# Altium schematic sheet MCU_board_1.SchDoc
size A4; SheetNumber: 1; SheetTotal: 3
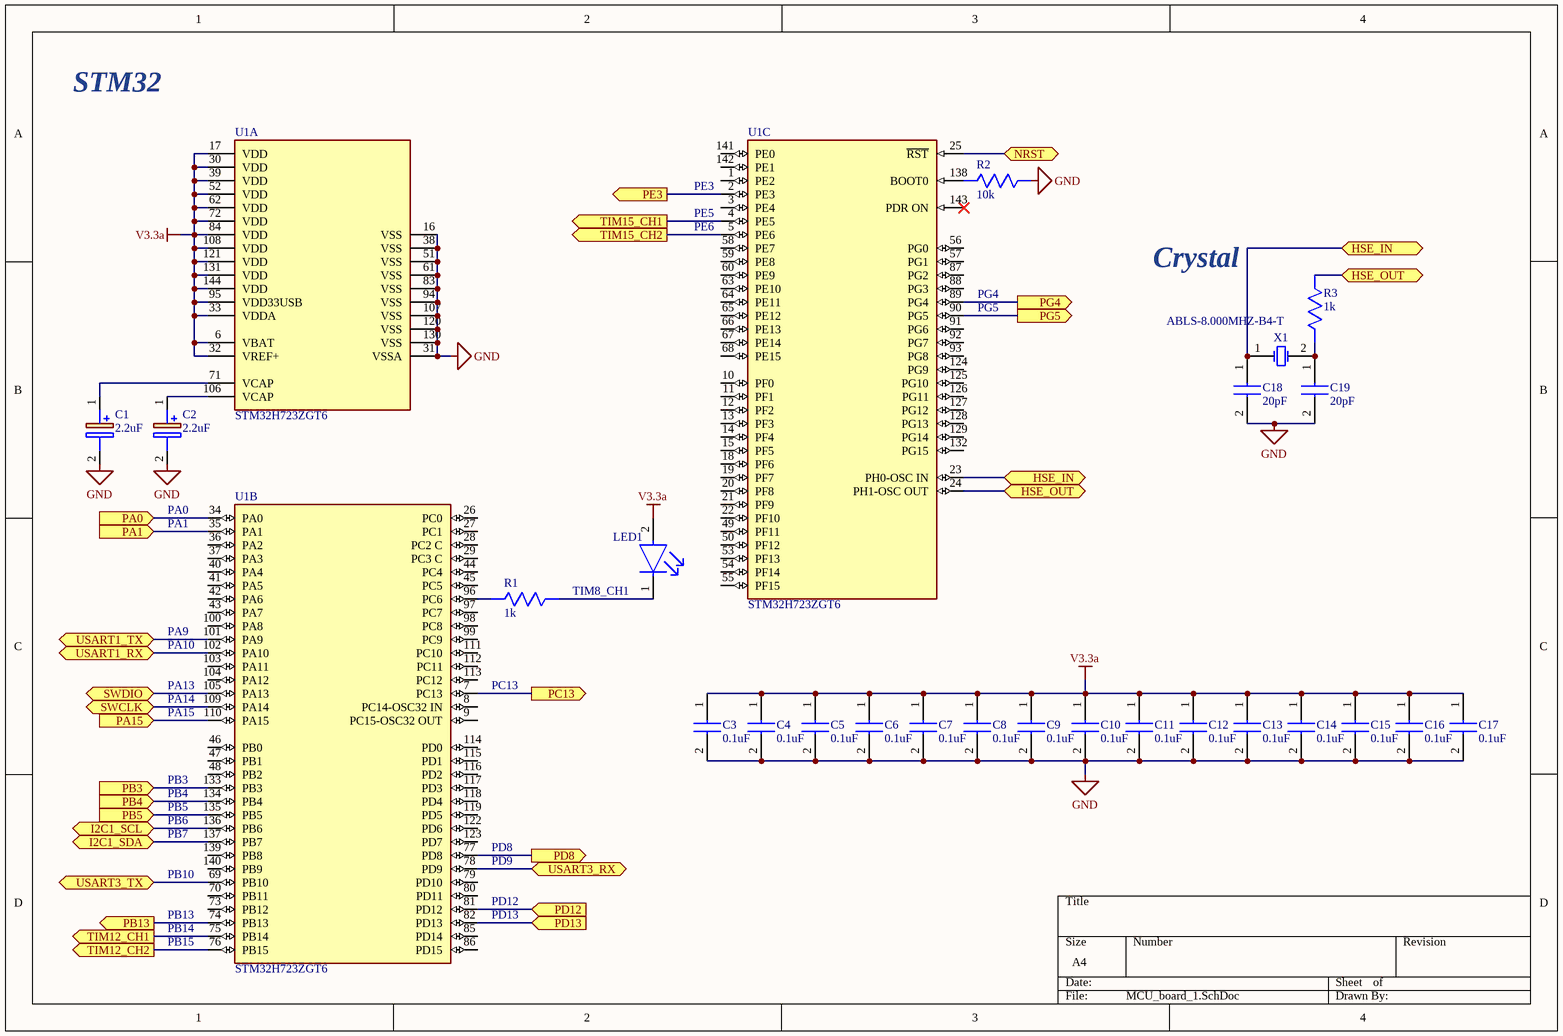
[diagram p0: MCU_board_1.SchDoc]

## Parts
(Parts that share a designator on the sheet are numbered #1, #2 ... from top to bottom, then left to right.)
C1  2.2uF  [T598B]
C2  2.2uF  [T598B]
C3  0.1uF  [CAPC1608X90N]
C4  0.1uF  [CAPC1608X90N]
C5  0.1uF  [CAPC1608X90N]
C6  0.1uF  [CAPC1608X90N]
C7  0.1uF  [CAPC1608X90N]
C8  0.1uF  [CAPC1608X90N]
C9  0.1uF  [CAPC1608X90N]
C10  0.1uF  [CAPC1608X90N]
C11  0.1uF  [CAPC1608X90N]
C12  0.1uF  [CAPC1608X90N]
C13  0.1uF  [CAPC1608X90N]
C14  0.1uF  [CAPC1608X90N]
C15  0.1uF  [CAPC1608X90N]
C16  0.1uF  [CAPC1608X90N]
C17  0.1uF  [CAPC1608X90N]
C18  20pF  [CAPC1608X90N]
C19  20pF  [CAPC1608X90N]
LED1  150060RS75000  [FP-150060RS75000-MFG]  (value not drawn)
R1  1k  [RESC1608X55N]
R2  10k  [RESC1608X55N]
R3  1k  [RESC1608X55N]
U1#1  STM32H723ZGT6  [FP-LQFP144-1A-IPC_A]  (part A of 3)
U1#2  STM32H723ZGT6  [FP-LQFP144-1A-IPC_C]  (parts B,C of 3)
X1  ABLS-8.000MHZ-B4-T  [ABRA-ABLS-14.7456MHZ-B2-T_V]

## Ports
HSE_IN (bidir, see MCU_board_1[3B]), HSE_IN (bidir, see MCU_board_1[4A]), HSE_OUT (bidir, see MCU_board_1[3B]), HSE_OUT (bidir, see MCU_board_1[4B]), I2C1_SCL (bidir, see MCU_board_3[1B]), I2C1_SDA (bidir, see MCU_board_3[1B]), NRST (bidir, see MCU_board_2[1C], MCU_board_2[2C], MCU_board_3[1C]), PA0 (in, see MCU_board_3[3C]), PA1 (in, see MCU_board_3[3C]), PA15 (in, see MCU_board_3[2C]), PB3 (in, see MCU_board_3[1C], MCU_board_3[2C]), PB4 (in, see MCU_board_3[3C]), PB5 (in, see MCU_board_3[3C]), PB13 (out, see MCU_board_3[3D]), PC13 (out, see MCU_board_3[3D]), PD8 (out, see MCU_board_3[3D]), PD12 (in, see MCU_board_3[4C]), PD13 (in, see MCU_board_3[4C]), PE3 (out, see MCU_board_3[3D]), PG4 (out, see MCU_board_2[1D]), PG5 (out, see MCU_board_2[2D]), SWCLK (bidir, see MCU_board_3[2C]), SWDIO (bidir, see MCU_board_3[2C]), TIM12_CH1 (out, see MCU_board_3[3D]), TIM12_CH2 (out, see MCU_board_3[3D]), TIM15_CH1 (out, see MCU_board_3[3D]), TIM15_CH2 (out, see MCU_board_3[3C]), USART1_RX (bidir, see MCU_board_2[4C], MCU_board_3[1A]), USART1_TX (bidir, see MCU_board_2[4C], MCU_board_3[1A]), USART3_RX (bidir, see MCU_board_3[2A]), USART3_TX (bidir, see MCU_board_3[2A])

## Nets
GND: C1.2(-) C2.2(-) C3.2 C4.2 C5.2 C6.2 C7.2 C8.2 C9.2 C10.2 C11.2 C12.2 C13.2 C14.2 C15.2 C16.2 C17.2 C18.2 C19.2 R2.2 U1#1.16(VSS) U1#1.31(VSSA) U1#1.38(VSS) U1#1.51(VSS) U1#1.61(VSS) U1#1.83(VSS) U1#1.94(VSS) U1#1.107(VSS) U1#1.120(VSS) U1#1.130(VSS)
V3.3a: C3.1 C4.1 C5.1 C6.1 C7.1 C8.1 C9.1 C10.1 C11.1 C12.1 C13.1 C14.1 C15.1 C16.1 C17.1 LED1.2(A) U1#1.6(VBAT) U1#1.17(VDD) U1#1.30(VDD) U1#1.32(VREF+) U1#1.33(VDDA) U1#1.39(VDD) U1#1.52(VDD) U1#1.62(VDD) U1#1.72(VDD) U1#1.84(VDD) U1#1.95(VDD33USB) U1#1.108(VDD) U1#1.121(VDD) U1#1.131(VDD) U1#1.144(VDD)
HSE_IN: C18.1 U1#2.23(PH0-OSC_IN) X1.1(X1) ; port HSE_IN
HSE_OUT: R3.2 U1#2.24(PH1-OSC_OUT) ; port HSE_OUT
I2C1_SCL: U1#2.136(PB6) ; port I2C1_SCL
I2C1_SDA: U1#2.137(PB7) ; port I2C1_SDA
NRST: U1#2.25(~{RST}) ; port NRST
PA0: U1#2.34(PA0) ; port PA0
PA1: U1#2.35(PA1) ; port PA1
PA15: U1#2.110(PA15) ; port PA15
PB3: U1#2.133(PB3) ; port PB3
PB4: U1#2.134(PB4) ; port PB4
PB5: U1#2.135(PB5) ; port PB5
PB13: U1#2.74(PB13) ; port PB13
PC13: U1#2.7(PC13) ; port PC13
PD8: U1#2.77(PD8) ; port PD8
PD12: U1#2.81(PD12) ; port PD12
PD13: U1#2.82(PD13) ; port PD13
PE3: U1#2.2(PE3) ; port PE3
PG4: U1#2.89(PG4) ; port PG4
PG5: U1#2.90(PG5) ; port PG5
SWCLK: U1#2.109(PA14) ; port SWCLK
SWDIO: U1#2.105(PA13) ; port SWDIO
TIM12_CH1: U1#2.75(PB14) ; port TIM12_CH1
TIM12_CH2: U1#2.76(PB15) ; port TIM12_CH2
TIM15_CH1: U1#2.4(PE5) ; port TIM15_CH1
TIM15_CH2: U1#2.5(PE6) ; port TIM15_CH2
USART1_RX: U1#2.102(PA10) ; port USART1_RX
USART1_TX: U1#2.101(PA9) ; port USART1_TX
USART3_RX: U1#2.78(PD9) ; port USART3_RX
USART3_TX: U1#2.69(PB10) ; port USART3_TX
NetC1_1: C1.1(+) U1#1.71(VCAP)
NetC2_1: C2.1(+) U1#1.106(VCAP)
NetC19_1: C19.1 R3.1 X1.2(X2)
NetLED1_1: LED1.1(C) R1.2
NetR1_1: R1.1 U1#2.96(PC6)
NetR2_1: R2.1 U1#2.138(BOOT0)

Not connected (* = marked no-connect by the designer): U1#2 1(PE2) 3(PE4) 8(PC14-OSC32_IN) 9(PC15-OSC32_OUT) 10(PF0) 11(PF1) 12(PF2) 13(PF3) 14(PF4) 15(PF5) 18(PF6) 19(PF7) 20(PF8) 21(PF9) 22(PF10) 26(PC0) 27(PC1) 28(PC2_C) 29(PC3_C) 36(PA2) 37(PA3) 40(PA4) 41(PA5) 42(PA6) 43(PA7) 44(PC4) 45(PC5) 46(PB0) 47(PB1) 48(PB2) 49(PF11) 50(PF12) 53(PF13) 54(PF14) 55(PF15) 56(PG0) 57(PG1) 58(PE7) 59(PE8) 60(PE9) 63(PE10) 64(PE11) 65(PE12) 66(PE13) 67(PE14) 68(PE15) 70(PB11) 73(PB12) 79(PD10) 80(PD11) 85(PD14) 86(PD15) 87(PG2) 88(PG3) 91(PG6) 92(PG7) 93(PG8) 97(PC7) 98(PC8) 99(PC9) 100(PA8) 103(PA11) 104(PA12) 111(PC10) 112(PC11) 113(PC12) 114(PD0) 115(PD1) 116(PD2) 117(PD3) 118(PD4) 119(PD5) 122(PD6) 123(PD7) 124(PG9) 125(PG10) 126(PG11) 127(PG12) 128(PG13) 129(PG14) 132(PG15) 139(PB8) 140(PB9) 141(PE0) 142(PE1) 143(PDR_ON)*

## Notes on the sheet
- STM32
- (near U1#2) PE3
- (near U1#2) PE5
- (near U1#2) PE6
- (near U1#2) PG4
- (near U1#2) PG5
- Crystal
- PA0
- PA1
- (near U1#2) PA9
- (near U1#2) PA10
- TIM8_CH1
- (near U1#2) PA13
- (near U1#2) PA14
- (near U1#2) PA15
- (near U1#2) PC13
- (near U1#2) PB3
- (near U1#2) PB4
- (near U1#2) PB5
- (near U1#2) PB6
- (near U1#2) PB7
- (near U1#2) PD8
- (near U1#2) PB10
- (near U1#2) PB13
- (near U1#2) PD9
- (near U1#2) PD12
- (near U1#2) PD13
- (near U1#2) PB14
- (near U1#2) PB15

## Library data of the parts
C1 C2 = T598B225M035ATE150: Capacitor Polarised; Manufacturer_Name: KEMET; Datasheet Link: https://content.kemet.com/datasheets/KEM_T2073_T59X.pdf; Height: 2.1mm; Manufacturer_Part_Number: T598B225M035ATE150; Mouser Part Number: 80-T598B225M35ATE150; Mouser Price/Stock: https://www.mouser.co.uk/ProductDetail/KEMET/T598B225M035ATE150?qs=wnTfsH77Xs5uc%252Bb8LBvYtg%3D%3D
C3-C17 = GRM188R72A104MA35D: Capacitor; Manufacturer_Name: Murata Electronics; Height: 0.9mm; Manufacturer_Part_Number: GRM188R72A104MA35D; Mouser Part Number: 81-GRM188R72A104MA5D; Mouser Price/Stock: https://www.mouser.co.uk/ProductDetail/Murata-Electronics/GRM188R72A104MA35D?qs=QdePRyQsNGaEtttrWFG%2FPQ%3D%3D; Arrow Part Number: GRM188R72A104MA35D; Arrow Price/Stock: https://www.arrow.com/en/products/grm188r72a104ma35d/murata-manufacturing?region=nac
C18 C19 = 06035A200FAT2A: Capacitor; Manufacturer_Name: AVX; Datasheet Link: https://componentsearchengine.com/Datasheets/1/06031A100FAT2A.pdf; Height: 0.9mm; Manufacturer_Part_Number: 06035A200FAT2A; Mouser Part Number: 581-06035A200FAT2A; Mouser Price/Stock: https://www.mouser.co.uk/ProductDetail/AVX/06035A200FAT2A?qs=0yaOSdwiqWsd0YnmvPoF5Q%3D%3D
LED1 = CMP-1426-00001-2: LED RED CLEAR 0603 SMD; Luminous Intensity: 250mcd; Viewing Angle: 140°; Dominant Wavelength: 625nm; Test Current: 20mA; Forward Current: 30mA; Forward Voltage: 2V; Lens Color: Colorless; Lens Size: 0.7mm; Width: 0.8mm; Series: WL-SMCW; Color: Red; Min Operating Temperature: -40°C; RoHS Compliant: Yes; Height: 0.8mm; Package Quantity: 1; Packaging: Cut Tape; Mount: Surface Mount; Case/Package: 0603; Lens Transparency: Clear; Length: 1.6mm; Case Code (Imperial): 0603; Lens Style: Clear; Wavelength: 625nm; Max Operating Temperature: 85°C; Case Code (Metric): 1608
R1-R3 = CMP0603-FX-1003ELF: Resistor; Manufacturer_Name: Bourns; Datasheet Link: https://www.mouser.co.uk/datasheet/2/54/Bourns_CMP_Datasheet_05.28.20-1854233.pdf; Height: 0.55mm; Manufacturer_Part_Number: CMP0603-FX-1003ELF
U1#1 U1#2 = CMP-12105-000148-1: IC MCU 32BIT 1MB FLASH 144LQFP
X1 = CMP-2000-05726-1: Low Profile Crystal, 8.0 MHz, +/- 30 ppm, -20 to 70 degC, 2-Pin SMD, RoHS, Tape and Reel; Brand: ABRACON; Case Length: 11.4mm; Frequency Stability: 50PPM; ESR: 80Ohms; Case Height: 4.2mm; Tolerance: 30PPM; Frequency: 8MHz; Case Width: 4.7mm; Load Capacitance: 18pF; Datasheet Version: 04/2011; Termination Style: SMD/SMT; Dimensions: 4.7mmWx11.4mmLx4.2mmH; Packaging: Reel; Manufacturer: ABRACON; Package URL: http://www.abracon.com/Support/PackageDrawing/Resonators/ABLS-2D.pdf; Mounting Technology: SurfaceMount; Package Reference: ABLS-14.7456MHZ-B2-T; Product Category: Crystals; Package Description: 2-Pin Surface Mount Device, Body 11.4 x 4.7 mm; Package / Case: HC-49/US; Mounting Style: SMD/SMT; Operating Temperature Range: -20Cto+70C; Series: ABLS; Factory Pack Quantity: 1000; Datasheet URL: http://www.abracon.com/Resonators/abls.pdf; Manufacturer URL: http://www.abracon.com/; RoHS: Details; Type: LowProfileMicroprocessorCrystal